# Altium project HKCitVDR_PCB.PrjPCB
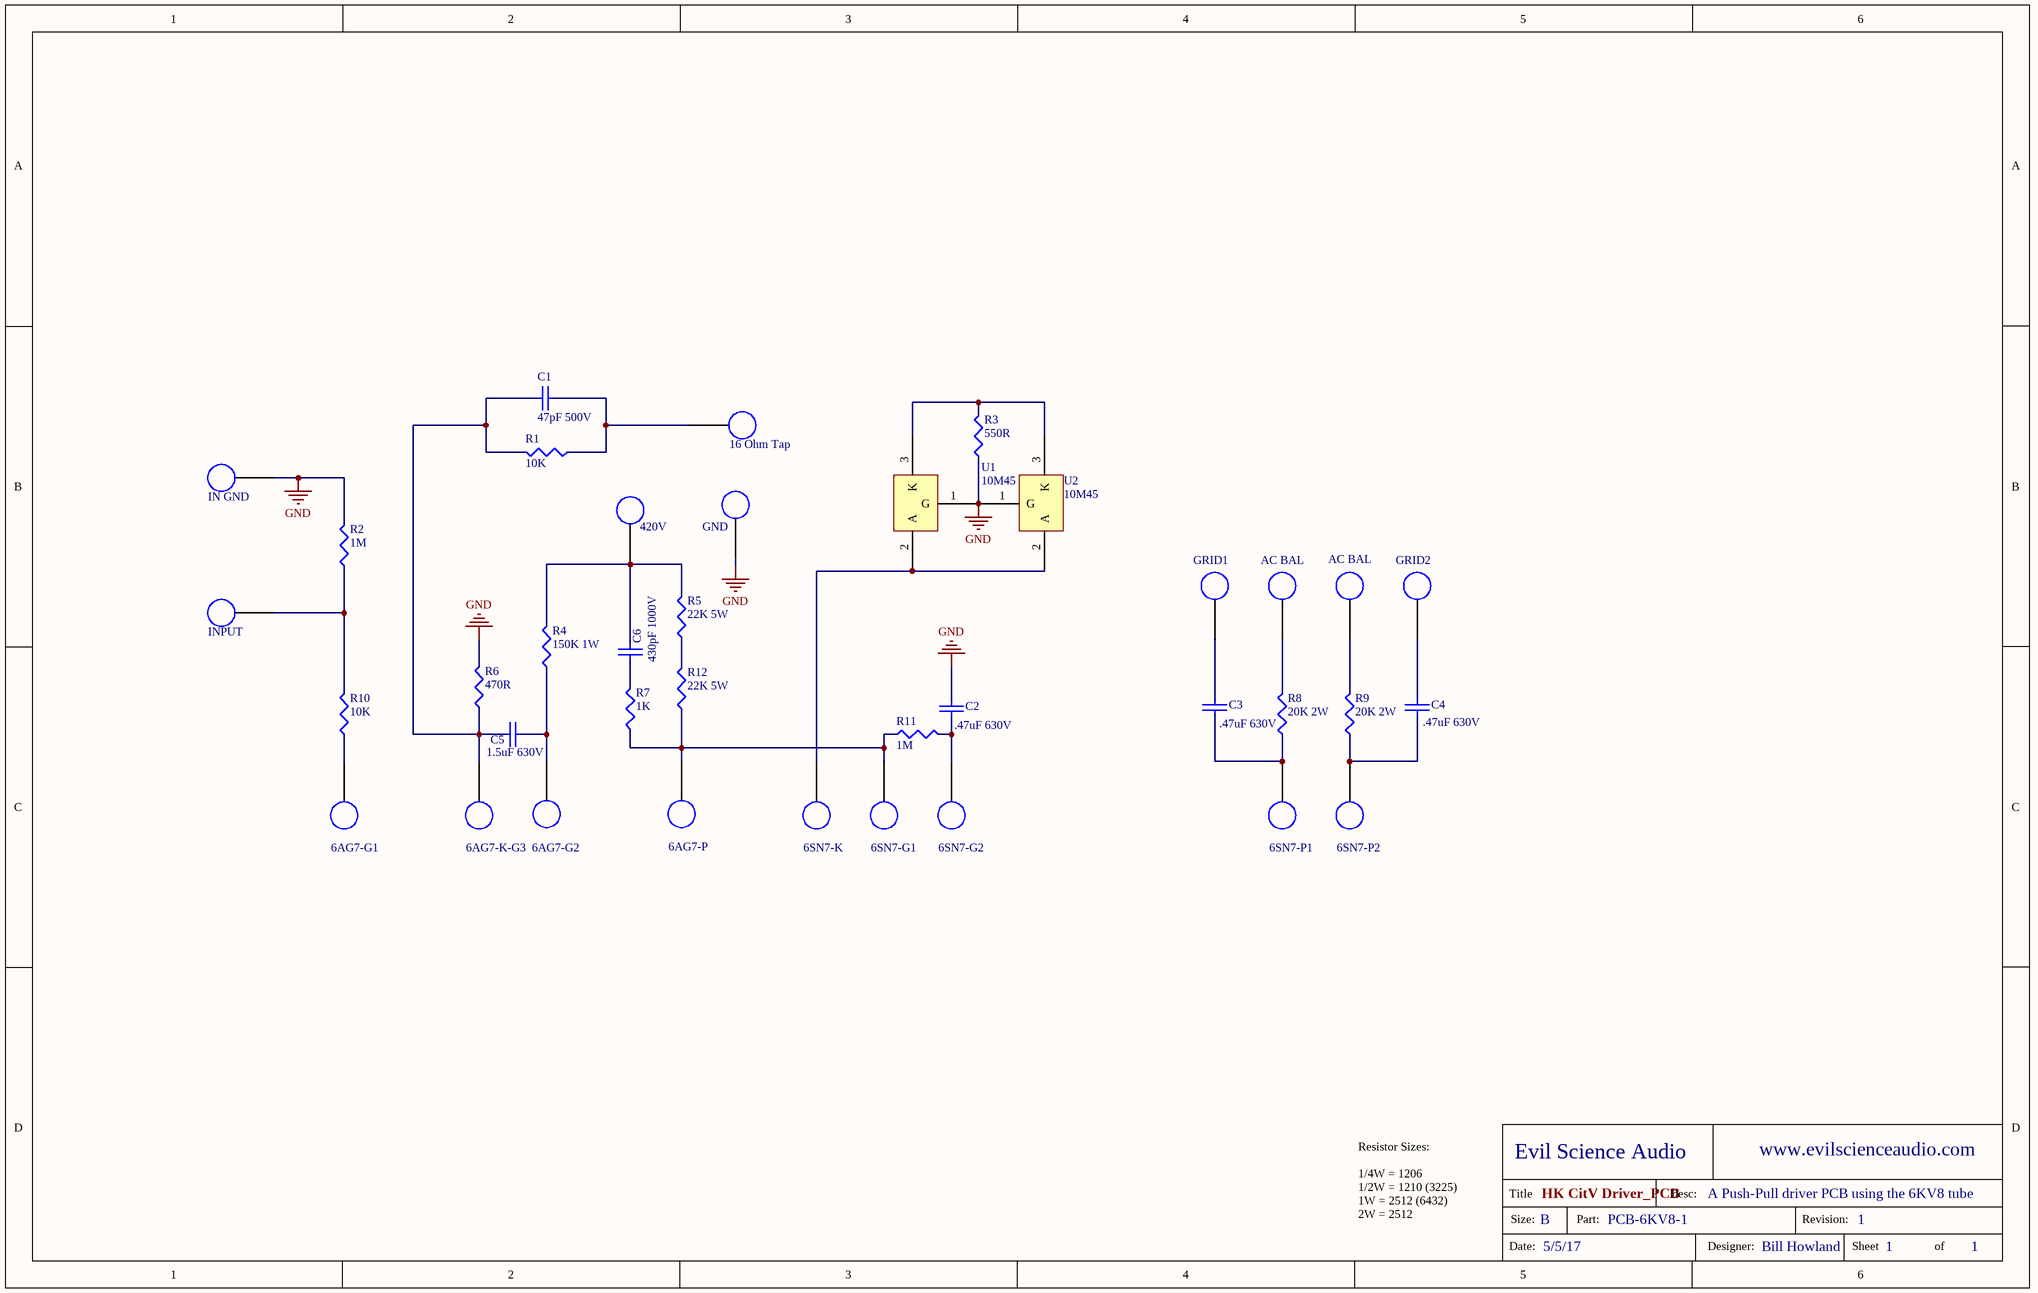
[diagram p0: HKCitVDR_PCB.SchDoc]
1 sheet, 38 parts. Net scope: global (net labels, ports and power ports of the same name join across sheets).
Board file: HKCitVDR_PCB.PcbDoc

## Sheet HKCitVDR_PCB.SchDoc: Title
size B; Engineer: Bill Howland; Organization: Altium Limited; Address1: L3, 12a Rodborough Rd; Address2: Frenchs Forest; Address3: NSW; Address4: Australia 2086; Revision: 1; SheetNumber: 1; SheetTotal: 1; MyDesc: A Push-Pull driver PCB using the 6KV8 tube; ShownDate: 5/5/17

### Parts
C1  47pF 500V  [CDE 47PF MICA]
C2  .47uF 630V  [SOLEN .47/630]
C3  .47uF 630V  [SOLEN .47/630]
C4  .47uF 630V  [SOLEN .47/630]
C5  1.5uF 630V  [SOLEN 1.5/630]
C6  430pF 1000V  [CDE 430PF MICA]
R1  10K  [RES 1/4W THRU_HOLE]
R2  1M  [RES 1/4W THRU_HOLE]
R3  550R  [RES 1/4W THRU_HOLE]
R4  150K 1W  [RES 1W THRU_HOLE]
R5  22K 5W  [RES 5W THRU_HOLE]
R6  470R  [RES 1/4W THRU_HOLE]
R7  1K  [RES 1/4W THRU_HOLE]
R8  20K 2W  [RES 2W THRU_HOLE]
R9  20K 2W  [RES 2W THRU_HOLE]
R10  10K  [RES 1/4W THRU_HOLE]
R11  1M  [RES 1/4W THRU_HOLE]
R12  22K 5W  [RES 5W THRU_HOLE]
TP1  16 Ohm Tap  [Test_Point]
TP2  INPUT  [Test_Point]
TP3  IN GND  [Test_Point]
TP4  GRID1  [Test_Point]
TP5  AC BAL  [Test_Point]
TP6  AC BAL  [Test_Point]
TP7  GRID2  [Test_Point]
TP8  6AG7-G1  [Test_Point]
TP9  6AG7-K-G3  [Test_Point]
TP10  6AG7-G2  [Test_Point]
TP11  GND  [Test_Point]
TP12  6AG7-P  [Test_Point]
TP13  6SN7-K  [Test_Point]
TP14  6SN7-G1  [Test_Point]
TP15  6SN7-G2  [Test_Point]
TP16  6SN7-P1  [Test_Point]
TP17  6SN7-P2  [Test_Point]
TP18  420V  [Test_Point]
U1  10M45  [TO-252AA]
U2  10M45  [TO-252AA]

### Nets
GND: C2.2 R2.2 R3.1 R6.2 TP3.1 TP11.1 U1.1(G) U2.1(G)
NetC1_1: C1.1 C5.1 R1.2 R6.1 TP9.1
NetC1_2: C1.2 R1.1 TP1.1
NetC2_1: C2.1 R11.2 TP15.1
NetC3_1: C3.1 R8.1 TP16.1
NetC3_2: C3.2 TP4.1
NetC4_1: C4.1 R9.1 TP17.1
NetC4_2: C4.2 TP7.1
NetC5_2: C5.2 R4.1 TP10.1
NetC6_1: C6.1 R4.2 R5.2 TP18.1
NetC6_2: C6.2 R7.2
NetR2_1: R2.1 R10.2 TP2.1
NetR3_2: R3.2 U1.3(K) U2.3(K)
NetR5_1: R5.1 R12.2
NetR7_1: R7.1 R11.1 R12.1 TP12.1 TP14.1
NetR8_2: R8.2 TP5.1
NetR9_2: R9.2 TP6.1
NetR10_1: R10.1 TP8.1
NetTP13_1: TP13.1 U1.2(A) U2.2(A)

### Notes on the sheet
- Evil Science Audio
- www.evilscienceaudio.com
- Resistor Sizes:
  1/4W = 1206
  1/2W = 1210 (3225)
  1W = 2512 (6432)
  2W = 2512
- Title
- Size:
- B
- HK CitV Driver_PCB
- Part:
- PCB-6KV8-1
- Desc:
- Revision:
- Date:
- Designer:
- Sheet
- of

### Library data of the parts
C1-C6 = CAP_6: Capacitor; Mfg Part Num: C3216X7R1H474K; MyPartType: C; Value: 470000; Line: 26; AMAT Stuff: Yes; OutputSort: 0; BASF Stuff: Yes; PartType: C
R1-R12 = RES_THRU
TP1-TP18 = Test_Point1